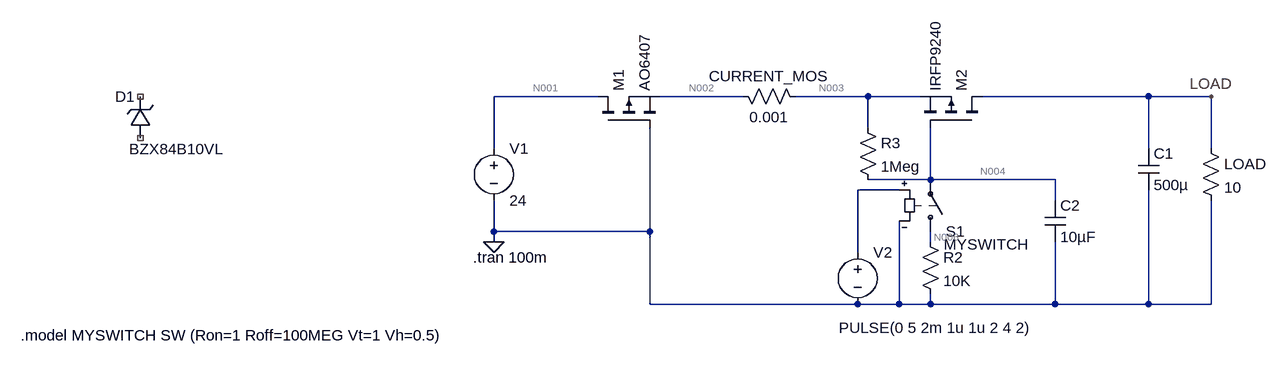
[diagram p0: schematic Reverse Protection - Switch - Inrush Current Protection.asc]
Reverse Protection - Switch - Inrush Current Protection.asc, the LTspice schematic file:
Version 4
SHEET 1 1368 680
WIRE 144 64 -16 64
WIRE 368 64 240 64
WIRE 560 64 448 64
WIRE 640 64 560 64
WIRE 992 64 736 64
WIRE 1088 64 992 64
WIRE 560 112 560 64
WIRE -16 144 -16 64
WIRE 992 144 992 64
WIRE 1088 144 1088 64
WIRE 656 192 656 112
WIRE 656 192 560 192
WIRE 848 192 656 192
WIRE 608 208 544 208
WIRE 848 224 848 192
WIRE -16 272 -16 224
WIRE 224 272 224 112
WIRE 224 272 -16 272
WIRE -16 288 -16 272
WIRE 656 288 656 272
WIRE 544 304 544 208
WIRE 224 384 224 272
WIRE 544 384 224 384
WIRE 608 384 608 256
WIRE 608 384 544 384
WIRE 656 384 656 368
WIRE 656 384 608 384
WIRE 848 384 848 288
WIRE 848 384 656 384
WIRE 992 384 992 208
WIRE 992 384 848 384
WIRE 1088 384 1088 224
WIRE 1088 384 992 384
FLAG -16 288 0
FLAG 1088 64 LOAD
SYMBOL voltage -16 128 R0
WINDOW 123 0 0 Left 0
WINDOW 39 0 0 Left 0
SYMATTR InstName V1
SYMATTR Value 24
SYMBOL pmos 144 112 R270
SYMATTR InstName M1
SYMATTR Value AO6407
SYMBOL res 1072 128 R0
SYMATTR InstName LOAD
SYMATTR Value 10
SYMBOL sw 656 288 M180
WINDOW 3 21 -4 Left 2
SYMATTR Value MYSWITCH
SYMATTR InstName S1
SYMBOL voltage 544 288 R0
WINDOW 3 -29 132 Left 2
WINDOW 123 0 0 Left 0
WINDOW 39 0 0 Left 0
SYMATTR Value PULSE(0 5 2m 1u 1u 2 4 2)
SYMATTR InstName V2
SYMBOL res 640 272 R0
SYMATTR InstName R2
SYMATTR Value 10K
SYMBOL zener -544 128 R180
WINDOW 0 24 64 Left 2
WINDOW 3 -112 -17 Left 2
SYMATTR InstName D1
SYMATTR Value BZX84B10VL
SYMBOL pmos 736 112 M270
SYMATTR InstName M2
SYMATTR Value IRFP9240
SYMBOL res 544 96 R0
SYMATTR InstName R3
SYMATTR Value 1Meg
SYMBOL res 352 48 M90
WINDOW 0 0 56 VBottom 2
WINDOW 3 32 56 VTop 2
SYMATTR InstName CURRENT_MOS
SYMATTR Value 0.001
SYMBOL cap 976 144 R0
SYMATTR InstName C1
SYMATTR Value 500µ
SYMBOL cap 832 224 R0
SYMATTR InstName C2
SYMATTR Value 10µF
TEXT -48 312 Left 2 !.tran 100m
TEXT -744 432 Left 2 !.model MYSWITCH SW (Ron=1 Roff=100MEG Vt=1 Vh=0.5)

The netlist it stands for:
* Reverse Protection - Switch - Inrush Current Protection.asc
V1 N001 0 24
M1 N001 0 N002 N002 AO6407
R§LOAD LOAD 0 10
S1 N006 N004 N005 0 MYSWITCH
V2 N005 0 PULSE(0 5 2m 1u 1u 2 4 2)
R2 N006 0 10K
D1 NC_01 NC_02 BZX84B10VL
M2 LOAD N004 N003 N003 IRFP9240
R3 N003 N004 1Meg
R§CURRENT_MOS N002 N003 0.001
C1 LOAD 0 500µ
C2 N004 0 10µF
.model D D
.lib standard.dio
.model NMOS NMOS
.model PMOS PMOS
.lib standard.mos
.tran 100m
.model MYSWITCH SW (Ron=1 Roff=100MEG Vt=1 Vh=0.5)
.backanno
.end

* Results of the author's LTspice run, read from the files saved beside the schematic
* Operating Point, zero values left out:
*   V(n001) = 24 V
*   V(n002) = 24 V
*   V(n006) = 2.376 mV
*   V(n004) = 23.76 V
*   V(n003) = 24 V
*   Id(M2) = -100 pA
*   Is(M2) = 100 pA
*   Id(M1) = 237.7 nA
*   Is(M1) = -237.7 nA
*   I(Current_mos) = 237.7 nA
*   I(R3) = 237.6 nA
*   I(R2) = 237.6 nA
*   I(Load) = 124 pA
*   I(S1) = 237.6 nA
*   I(V1) = -237.7 nA
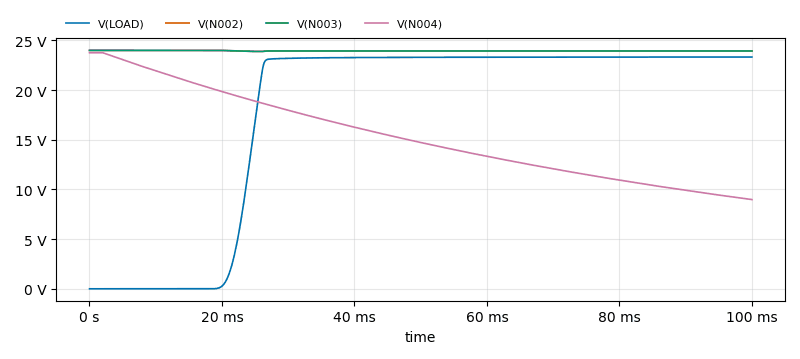
[diagram p1: Transient Analysis of Reverse Protection - Switch - Inrush Current Protection.asc, plotted from the saved traces]
* Transient Analysis, 1 run:
*   V(LOAD): min 0 V, max 23.33 V, average 17.76 V, rms 20.21 V, last 23.33 V
*   V(N002): min 23.89 V, max 24 V, average 23.95 V, rms 23.95 V, last 23.94 V
*   V(N003): min 23.89 V, max 24 V, average 23.95 V, rms 23.95 V, last 23.94 V
*   V(N004): min 8.984 V, max 23.76 V, average 15.35 V, rms 15.96 V, last 8.984 V